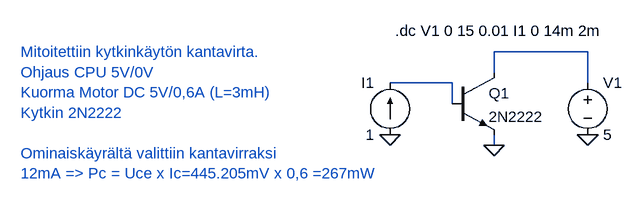
[diagram p0: schematic Transistorikytkin_ominaiskäyrä.asc]
Transistorikytkin_ominaiskäyrä.asc, the LTspice schematic file:
Version 4
SHEET 1 880 680
WIRE 368 80 224 80
WIRE 224 112 224 80
WIRE 160 128 64 128
WIRE 368 128 368 80
WIRE 160 160 160 128
WIRE 224 224 224 208
FLAG 64 208 0
FLAG 224 224 0
FLAG 368 208 0
SYMBOL npn 160 112 R0
SYMATTR InstName Q1
SYMATTR Value 2N2222
SYMBOL voltage 368 112 R0
WINDOW 123 0 0 Left 2
WINDOW 39 0 0 Left 2
SYMATTR InstName V1
SYMATTR Value 5
SYMBOL current 64 208 R180
WINDOW 0 24 80 Left 2
WINDOW 3 24 0 Left 2
WINDOW 123 0 0 Left 2
WINDOW 39 0 0 Left 2
SYMATTR InstName I1
SYMATTR Value 1
TEXT 72 48 Left 2 !.dc V1 0 15 0.01 I1 0 14m 2m
TEXT -504 80 Left 2 ;Mitoitettiin kytkinkäytön kantavirta.\nOhjaus CPU 5V/0V\nKuorma Motor DC 5V/0,6A (L=3mH)\nKytkin 2N2222\n \nOminaiskäyrältä valittiin kantavirraksi\n12mA => Pc = Uce x Ic=445.205mV x 0,6 =267mW

The netlist it stands for:
* Transistorikytkin_ominaiskäyrä.asc
Q1 N001 N002 0 0 2N2222
V1 N001 0 5
I1 0 N002 1
.model NPN NPN
.model PNP PNP
.lib standard.bjt
.dc V1 0 15 0.01 I1 0 14m 2m
* Mitoitettiin kytkinkäytön kantavirta.
* Ohjaus CPU 5V/0V
* Kuorma Motor DC 5V/0,6A (L=3mH)
* Kytkin 2N2222
* Ominaiskäyrältä valittiin kantavirraksi
* 12mA => Pc = Uce x Ic=445.205mV x 0,6 =267mW
.backanno
.end